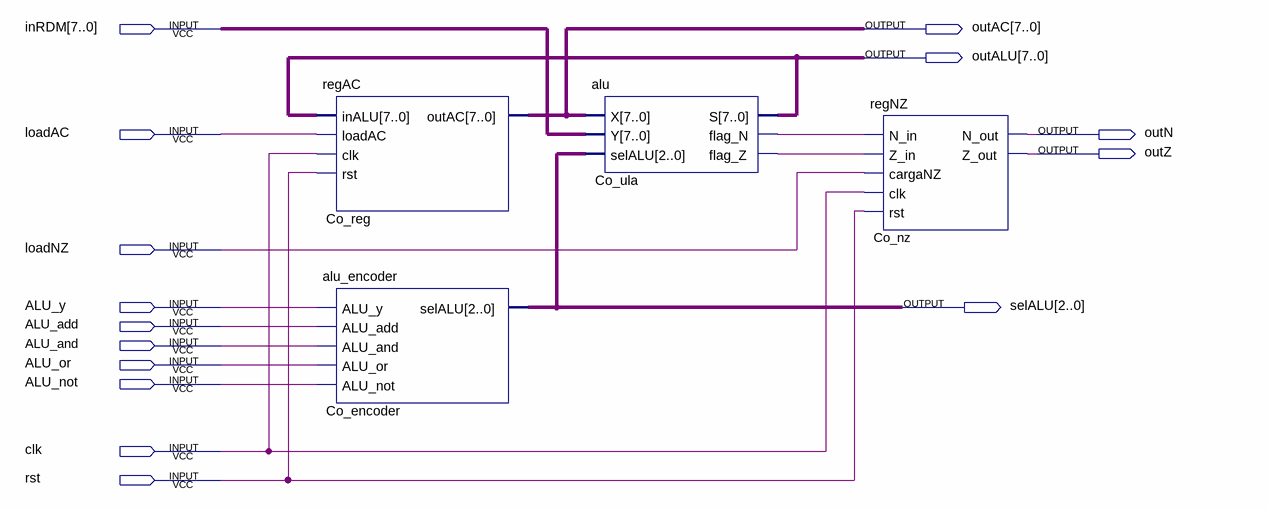
[diagram p0: schematic sheet]
// Quartus schematic test_mega_alu.bdf as structural Verilog: 4 symbols, 15 pins
module test_mega_alu (
  input  [7:0] inRDM,
  input  loadAC,
  input  loadNZ,
  input  ALU_y,
  input  ALU_add,
  input  ALU_and,
  input  ALU_or,
  input  ALU_not,
  input  clk,
  input  rst,
  output [7:0] outAC,
  output [7:0] outALU,
  output outN,
  output outZ,
  output [2:0] selALU
);

  wire Co_ula_flag_n, Co_ula_flag_z;

  regAC Co_reg (.inALU(outALU), .loadAC(loadAC), .clk(clk), .rst(rst), .outAC(outAC));
  alu_encoder Co_encoder (
    .ALU_y(ALU_y), .ALU_add(ALU_add), .ALU_and(ALU_and), .ALU_or(ALU_or), .ALU_not(ALU_not), .selALU(selALU));
  alu Co_ula (.X(outAC), .Y(inRDM), .selALU(selALU), .S(outALU), .flag_N(Co_ula_flag_n), .flag_Z(Co_ula_flag_z));
  regNZ Co_nz (
    .N_in(Co_ula_flag_n), .Z_in(Co_ula_flag_z), .cargaNZ(loadNZ), .clk(clk), .rst(rst), .N_out(outN),
    .Z_out(outZ));
endmodule
